# Altium schematic sheet Shc_Encoder_Optic_Sensor.SchDoc
size A4
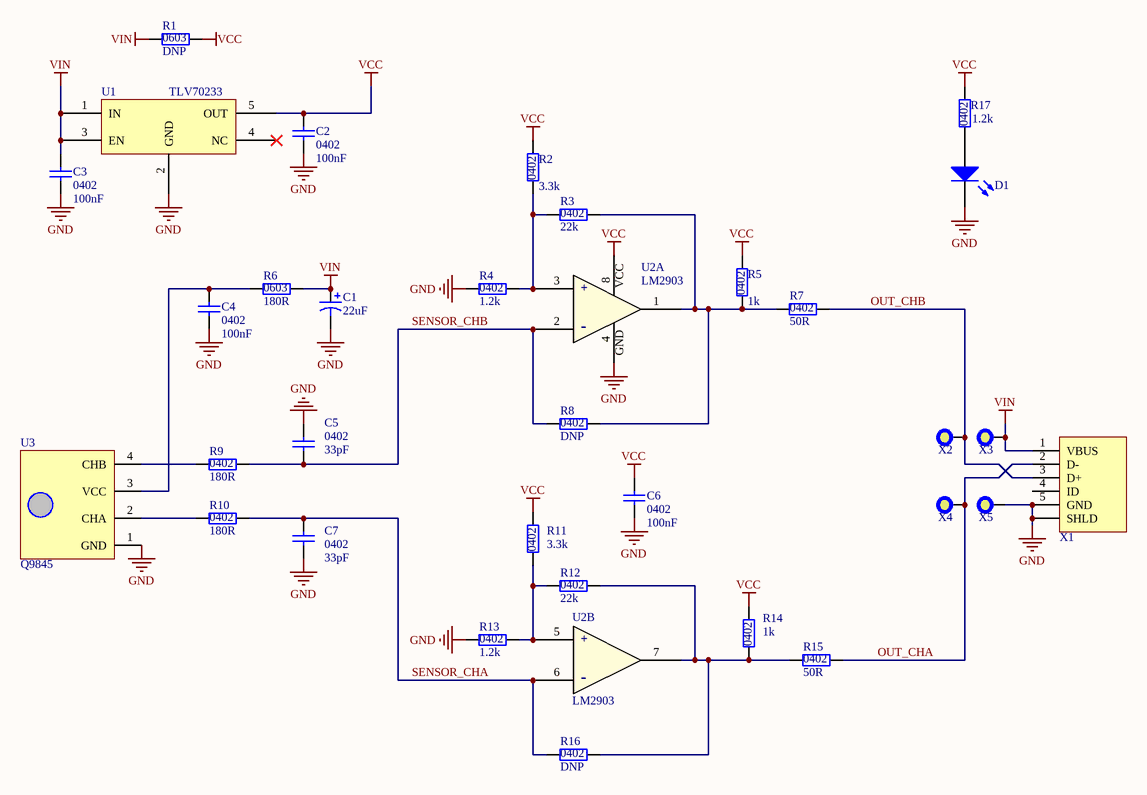
[diagram p0: Shc_Encoder_Optic_Sensor.SchDoc]

## Parts
C1  value 22uF  [TCAP SMA]  (hidden comment: TCAP CASE A)
C2  value 100nF  Case: 0402  [C0402-h0.5-O]  (hidden comment: Ceramic Capacitor X7R 10% 50V)
C3  value 100nF  Case: 0402  [C0402-h0.5-O]  (hidden comment: Ceramic Capacitor X7R 10% 50V)
C4  value 100nF  Case: 0402  [C0402-h0.5-O]  (hidden comment: Ceramic Capacitor X7R 10% 50V)
C5  value 33pF  Case: 0402  [C0402-h0.5-O]  (hidden comment: Ceramic Capacitor X7R 10% 50V)
C6  value 100nF  Case: 0402  [C0402-h0.5-O]  (hidden comment: Ceramic Capacitor X7R 10% 50V)
C7  value 33pF  Case: 0402  [C0402-h0.5-O]  (hidden comment: Ceramic Capacitor X7R 10% 50V)
D1  LED 0603  [LED 0603_RED]  (value not drawn)
R1  value DNP  Case: 0603  [R0603]  (hidden comment: Thick Film Resistor 0603 5%)
R2  value 3.3k  Case: 0402  [R0402-O]  (hidden comment: Thick Film Resistor 0402 5%)
R3  value 22k  Case: 0402  [R0402-O]  (hidden comment: Thick Film Resistor 0402 5%)
R4  value 1.2k  Case: 0402  [R0402-O]  (hidden comment: Thick Film Resistor 0402 5%)
R5  value 1k  Case: 0402  [R0402-O]  (hidden comment: Thick Film Resistor 0402 5%)
R6  value 180R  Case: 0603  [R0603]  (hidden comment: Thick Film Resistor 0603 5%)
R7  value 50R  Case: 0402  [R0402-O]  (hidden comment: Thick Film Resistor 0402 5%)
R8  value DNP  Case: 0402  [R0402-O]  (hidden comment: Thick Film Resistor 0402 5%)
R9  value 180R  Case: 0402  [R0402-O]  (hidden comment: Thick Film Resistor 0402 5%)
R10  value 180R  Case: 0402  [R0402-O]  (hidden comment: Thick Film Resistor 0402 5%)
R11  value 3.3k  Case: 0402  [R0402-O]  (hidden comment: Thick Film Resistor 0402 5%)
R12  value 22k  Case: 0402  [R0402-O]  (hidden comment: Thick Film Resistor 0402 5%)
R13  value 1.2k  Case: 0402  [R0402-O]  (hidden comment: Thick Film Resistor 0402 5%)
R14  value 1k  Case: 0402  [R0402-O]  (hidden comment: Thick Film Resistor 0402 5%)
R15  value 50R  Case: 0402  [R0402-O]  (hidden comment: Thick Film Resistor 0402 5%)
R16  value DNP  Case: 0402  [R0402-O]  (hidden comment: Thick Film Resistor 0402 5%)
R17  value 1.2k  Case: 0402  [R0402-O]  (hidden comment: Thick Film Resistor 0402 5%)
U1  TLV70233  [SOT-23-5]
U2  LM2903  [SOIC-8-150]  (parts A,B of 2)
U3  Q9845  [SENSOR_OPTO-Encoder Rp]
X1  ZX62-AB-5PA(11)  [USB_micro_TH]  (value not drawn)
X2  PAD_C_1.2MM  [PAD_C_1.2mm]  (value not drawn)
X3  PAD_C_1.2MM  [PAD_C_1.2mm]  (value not drawn)
X4  PAD_C_1.2MM  [PAD_C_1.2mm]  (value not drawn)
X5  PAD_C_1.2MM  [PAD_C_1.2mm]  (value not drawn)

## Nets
GND: C1.- C2.1 C3.1 C4.1 C5.1 C6.1 C7.1 D1.2(K) R4.1 R13.1 U1.2(GND) U2.4(GND) U3.1(GND) X1.5(GND) X1.SH(SHLD) X5.1
VCC: C2.2 C6.2 R1.2 R2.1 R5.1 R11.1 R14.1 R17.2 U1.5(OUT) U2.8(VCC)
VIN: C1.+ C3.2 R1.1 R6.2 U1.1(IN) U1.3(EN) X1.1(VBUS) X3.1
OUT_CHA: R15.2 X1.2(D-) X4.1
OUT_CHB: R7.2 X1.3(D+) X2.1
SENSOR_CHA: C7.2 R10.2 R16.1 U2.6(2IN-)
SENSOR_CHB: C5.2 R8.1 R9.2 U2.2(1IN-)
NetC4_2: C4.2 R6.1 U3.3(VCC)
NetD1_1: D1.1(A) R17.1
NetR2_2: R2.2 R3.1 R4.2 U2.3(1IN+)
NetR3_2: R3.2 R5.2 R7.1 R8.2 U2.1(1OUT)
NetR9_1: R9.1 U3.4(CHB)
NetR10_1: R10.1 U3.2(CHA)
NetR11_2: R11.2 R12.1 R13.2 U2.5(2IN+)
NetR12_2: R12.2 R14.2 R15.1 R16.2 U2.7(2OUT)

Not connected (* = marked no-connect by the designer): U1 4(NC)*; X1 4(ID)

## Notes on the sheet
- (in symbol LM293 / LM2903, part A) +; -
- (in symbol LM293 / LM2903, part B) +; -

## Library data of the parts
C1 = TCAP CASE A: Tantal Capacitor SMA; LatestRevisionDate: 25.01.2012; PackageDescription: SMT case A
C2-C7 = Cap CER 0402 S: Multilayer ceramic capacitors  0402; Designer: Crom; LatestRevisionDate: 19.05.14
D1 = LED 0603: Typical SMT LED; Value: RED; LatestRevisionDate: 14.06.17
R1 R6 = Res 0603: Chip Resistor 0603 (1608); Designer: Crom; Latest Revision: 19.05.14
R2-R5 R7-R17 = Res 0402: Chip Resistor 0402 (1005) 1/16W; Designer: Crom; LatestRevisionDate: 19.05.14
U1 = TLV70233: LDO 3.3V 300mA
U2 = LM293 / LM2903: Dual Differential Comparators
U3 = Optic_Encoder_Sensor: Small Optical Encoder Module (HEDS-97xx)
X1 = USB_micro: USB micro AB SMT R/A; link: http://www.digikey.com/product-detail/en/ZX62-AB-5PA%2811%29/H11635CT-ND/1993370
X2-X5 = PAD_1.2MM: 1x1x0.8mm hole